# EAGLE schematic chipKIT-Uno32-Shield (EAGLE 6.2)
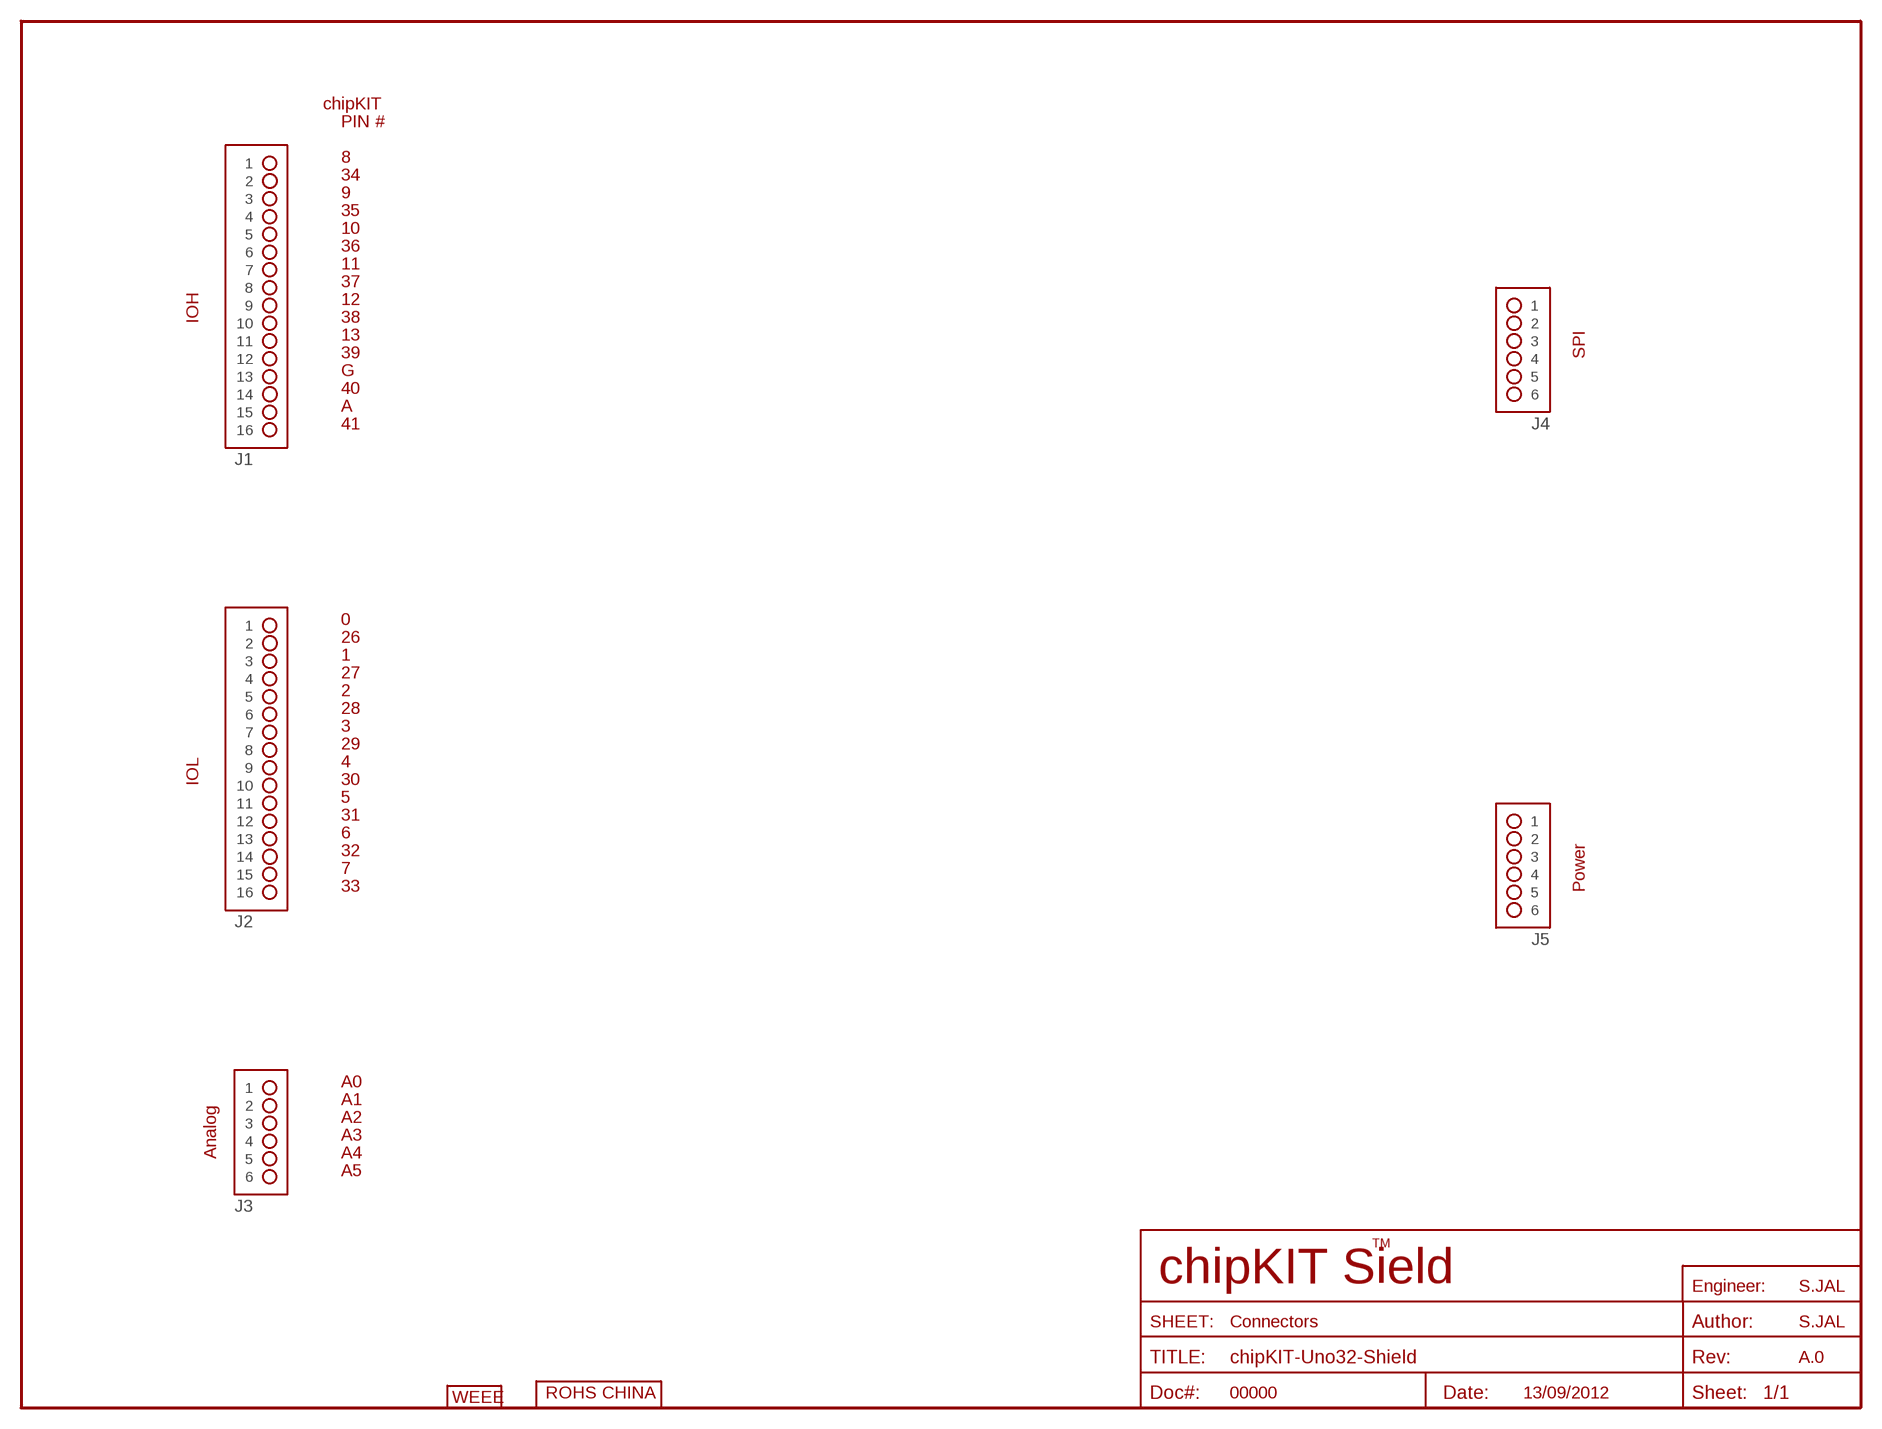
[diagram p0: schematic, sheet 1]

## Parts
J1  HDR-2X8  [HDR-2X8]
J2  HDR-2X8  [HDR-2X8]
J3  HDR-1X6  [HDR-1X6]
J4  No Load  HDR-2X3  [HDR-2X3]
J5  HDR-1X6  [HDR-1X6]
LOGO3  WEEE-L  [WEEE_LOGO2]
LOGO4  ROHS-CHINA  [ROHS_CHINA_LOGO]
Unconnected: J1.1 J1.2 J1.3 J1.4 J1.5 J1.6 J1.7 J1.8 J1.9 J1.10 J1.11 J1.12 J1.13 J1.14 J1.15 J1.16 J2.1 J2.2 J2.3 J2.4 J2.5 J2.6 J2.7 J2.8 J2.9 J2.10 J2.11 J2.12 J2.13 J2.14 J2.15 J2.16 J3.1 J3.2 J3.3 J3.4 J3.5 J3.6 J4.1 J4.2 J4.3 J4.4 J4.5 J4.6 J5.1 J5.2 J5.3 J5.4 J5.5 J5.6

## Notes on the sheet
- chipKIT
- PIN #
- 8
- 34
- 9
- 35
- 10
- 36
- 11
- 37
- 12
- IOH | 38
- 13
- 39 | SPI
- G
- 40
- A
- 41
- 0
- 26
- 1
- 27
- 2
- 28
- 3
- 29
- 4
- IOL | 30
- 5
- 31
- 6
- 32
- 7
- 33 | Power
- A0
- A1
- A2
- A3
- Analog | A4
- A5
- TM
- chipKIT Sield
- S.JAL
- Connectors | S.JAL
- A.0
- 00000 | 13/09/2012

## Library data of the parts
J1 J2 = Mechanical:HDR-2X8: 100mil 2x8 header
J3 J5 = Mechanical:HDR-1X6
J4 = Mechanical:HDR-2X3
LOGO3 = Logo:WEEE: WEEE Symbol
LOGO4 = Logo:ROHS-CHINA: Chinese ROHS symbol logo